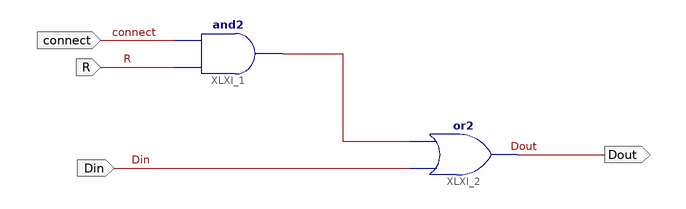
[diagram p0: schematic sheet 1]
// Xilinx ISE schematic connecteur.sch (spartan3e) as structural Verilog: 2 symbols, 4 ports
module connecteur (
  input  connect,
  input  R,
  input  Din,
  output Dout
);

  wire XLXN_3;

  and XLXI_1 (XLXN_3, R, connect);
  or XLXI_2 (Dout, Din, XLXN_3);
endmodule
